# Altium project efx.PrjPCB
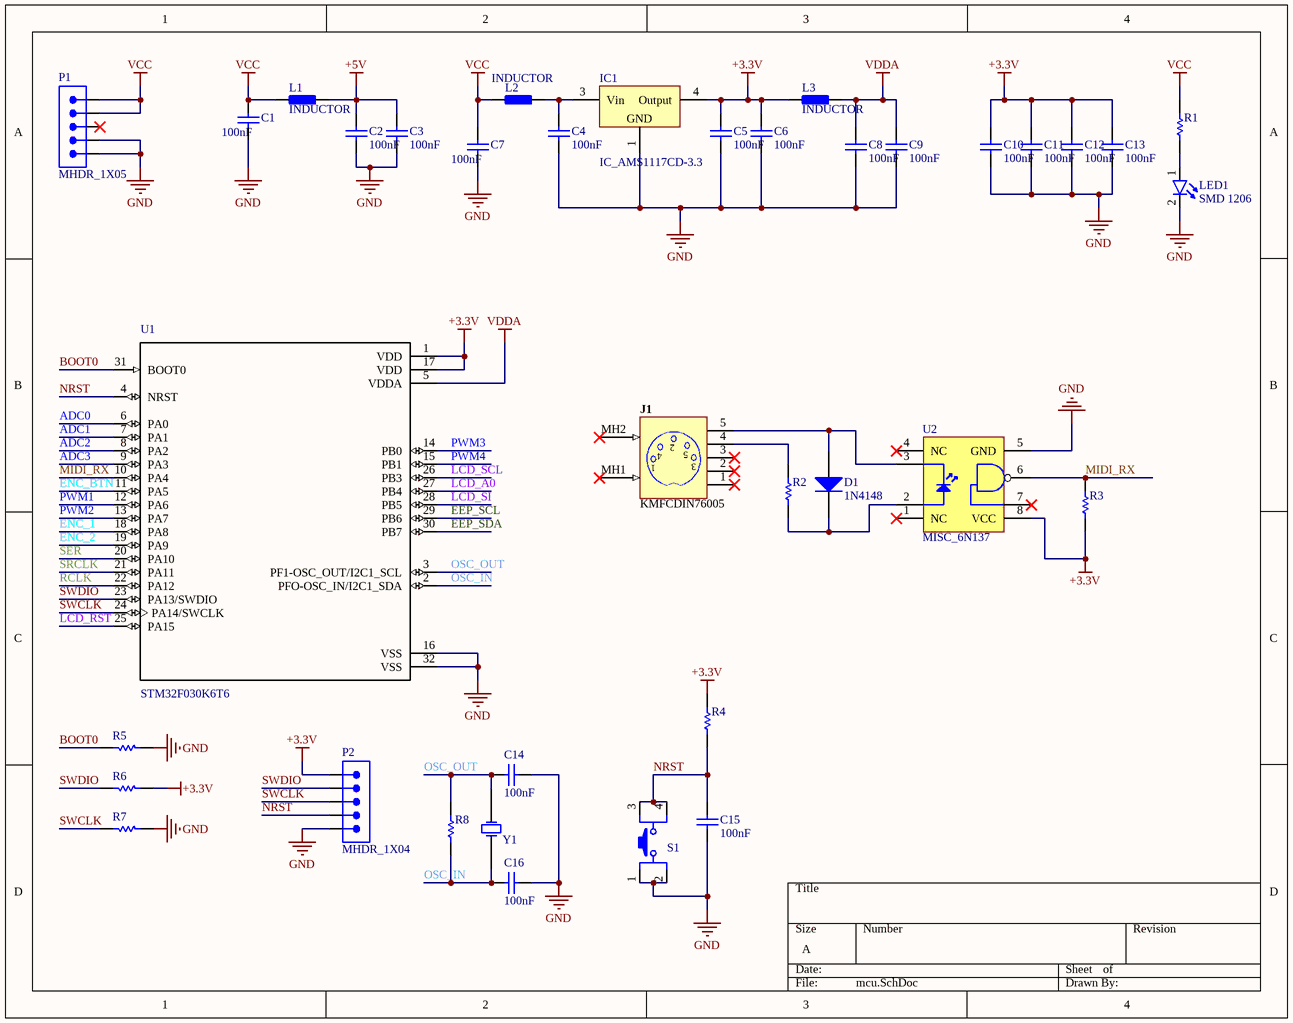
[diagram p0: mcu.SchDoc]
3 sheets, 120 parts. Net scope: global (net labels, ports and power ports of the same name join across sheets).
Board file: d_efx.PcbDoc
Sheets:
  mcu.SchDoc
  misc.SchDoc
  volumes.SchDoc

## Sheet mcu.SchDoc
size A

### Parts
C1  100nF  [CAPC3216M (1206)]
C2  100nF  [CAPC3216M (1206)]
C3  value 100nF  [CAPC3216M (1206)]  (hidden comment: 1uF)
C4  100nF  [CAPC3216M (1206)]
C5  100nF  [CAPC3216M (1206)]
C6  100nF  [CAPC3216M (1206)]
C7  100nF  [CAPC3216M (1206)]
C8  100nF  [CAPC3216M (1206)]
C9  value 100nF  [CAPC3216M (1206)]  (hidden comment: 1uF)
C10  100nF  [CAPC3216M (1206)]
C11  100nF  [CAPC3216M (1206)]
C12  100nF  [CAPC3216M (1206)]
C13  100nF  [CAPC3216M (1206)]
C14  100nF  [CAPC3216M (1206)]
C15  100nF  [CAPC3216M (1206)]
C16  100nF  [CAPC3216M (1206)]
D1  1N4148  [LL4148]
IC1  IC_AMS1117CD-3.3  [TO252-3M]
J1  KMFCDIN76005  [DIP_CON_DIN5]
L1  INDUCTOR  [INDC4532]
L2  INDUCTOR  [INDC4532]
L3  INDUCTOR  [INDC4532]
LED1  Size: SMD 1206  [LED SMD 1206]  (hidden comment: Red)
P1  MHDR_1X05  [MHDR1X05-254P]
P2  MHDR_1X04  [MHDR1X04-254P]
R1  1K  [RESC3216X60M (1206)]  (value not drawn)
R2  1K  [RESC3216X60M (1206)]  (value not drawn)
R3  1K  [RESC3216X60M (1206)]  (value not drawn)
R4  1K  [RESC3216X60M (1206)]  (value not drawn)
R5  1K  [RESC2012M (0805)]  (value not drawn)
R6  1K  [RESC3216X60M (1206)]  (value not drawn)
R7  1K  [RESC3216X60M (1206)]  (value not drawn)
R8  1K  [RESC3216X60M (1206)]  (value not drawn)
S1  SW_PB4A  [THT_ALPS_SKHHBVA010]  (value not drawn)
U1  STM32F030K6T6  [*QFP80P900X900X160-32N]
U2  MISC_6N137  [CDIP8]
Y1  11.0592 MHz  [XTAL]  (value not drawn)

### Nets
+3.3V: C5.1(+) C6.1(+) C10.1(+) C11.1(+) C12.1(+) C13.1(+) IC1.4(Output) L3.1 P2.1 R3.1 R4.2 R6.2 U1.1(VDD) U1.17(VDD) U2.8(VCC)
+5V: C2.1(+) C3.1(+) L1.2
GND: C1.2(-) C2.2(-) C3.2(-) C4.2(-) C5.2(-) C6.2(-) C7.2(-) C8.2(-) C9.2(-) C10.2(-) C11.2(-) C12.2(-) C13.2(-) C14.1(+) C15.2(-) C16.2(-) IC1.1(GND) LED1.2(K) P1.4 P1.5 P2.4 R5.2 R7.2 S1.1 S1.2 U1.16(VSS) U1.32(VSS) U2.5(GND)
VCC: C1.1(+) C7.1(+) L1.1 L2.1 P1.1 P1.2 R1.2
VDDA: C8.1(+) C9.1(+) L3.2 U1.5(VDDA)
ADC0: U1.6(PA0)
ADC1: U1.7(PA1)
ADC2: U1.8(PA2)
ADC3: U1.9(PA3)
BOOT0: R5.1 U1.31(BOOT0)
EEP_SCL: U1.29(PB6)
EEP_SDA: U1.30(PB7)
ENC_1: U1.18(PA8)
ENC_2: U1.19(PA9)
ENC_BTN: U1.11(PA5)
LCD_A0: U1.27(PB4)
LCD_RST: U1.25(PA15)
LCD_SCL: U1.26(PB3)
LCD_SI: U1.28(PB5)
MIDI_RX: R3.2 U1.10(PA4) U2.6(Vo)
NRST: C15.1(+) P2.4 R4.1 S1.3 S1.4 U1.4(NRST)
OSC_IN: C16.1(+) R8.1 U1.2(PFO-OSC_IN/I2C1_SDA) Y1.2(OSC2)
OSC_OUT: C14.2(-) R8.2 U1.3(PF1-OSC_OUT/I2C1_SCL) Y1.1(OSC1)
PWM1: U1.12(PA6)
PWM2: U1.13(PA7)
PWM3: U1.14(PB0)
PWM4: U1.15(PB1)
RCLK: U1.22(PA12)
SER: U1.20(PA10)
SRCLK: U1.21(PA11)
SWCLK: P2.3 R7.1 U1.24(PA14/SWCLK)
SWDIO: P2.2 R6.1 U1.23(PA13/SWDIO)
NetC4_1: C4.1(+) IC1.3(Vin) L2.2
NetD1_1: D1.1(A) J1.5 U2.3(K)
NetD1_2: D1.2(K) R2.2 U2.2(A)
NetJ1_4: J1.4 R2.1
NetLED1_1: LED1.1(A) R1.1

Not connected (* = marked no-connect by the designer): J1 1* 2* 3* MH1* MH2*; P1 3*; U2 1(NC)* 4(NC)* 7(Ve)*

### Library data of the parts
C1-C16 = CAP_Bipolar: Bipolar Capacitor; Voltage: 100V; Designer: Eng. Saeid Jorablo; Company: SJ Libraries; ComponentLink1Description: Datasheet; ComponentLink2Description: Reference; Publisher: SJ Unlimited; Mounting Technology: *; Mounting Technology: Surface Mount\Through-Hole; HelpURL: http://s3.picofile.com/file/7443264187/Coming_Soon_logo.gif; Status: Unreleased
  C1 C2 C4-C8 C10-C16: Value: 100nF
D1 = DIODE_1N4148: High Conductance Fast Diode; Designer: Eng. Saeid Jorablo; Company: SJ Libraries; Published: 8-Jun-2000; LatestRevisionDate: 17-Jul-2002; LatestRevisionNote: Re-released for DXP Platform.; PackageReference: DO-35; Publisher: SJ Unlimited; PackageDescription: Diode, Axial; Body 3.8 x 1.9 mm (LxDia. max), Lead Dia. 0.53 mm (max); Code_JEDEC: DO-204-AH; ComponentLink1Description: Datasheet; ComponentLink1URL: http://www.fairchildsemi.com/; ComponentLink2Description: Reference; ComponentLink2URL: http://www.fairchildsemi.com/ds/1N%2F1N4148.pdf; Mounting Technology: Surface Mount\Through-Hole; HelpURL: http://s3.picofile.com/file/7443264187/Coming_Soon_logo.gif; Status: Unreleased
IC1 = IC_AMS1117CD-3.3: 800mA LOW DROPOUT VOLTAGE REGULATOR; Manufacturer: Advanced Monolithic Systems, Inc.; Company: SJ Libraries; Designer: Eng. Saeid Jorablo; ESD Sensetive: True/False; Code_IPC: TO-252; ComponentLink1Description: Datasheet; ComponentLink1URL: http://www.advanced-monolithic.com/pdf/ds1117.pdf; ComponentLink2Description: Reference; ComponentLink2URL: http://www.advanced-monolithic.com/index.html; PackageDescription: D-PAK, 3-Pads, Body 6.2x6.7mm (max); PinCount: 3; Update: 6/5/2012; Category: Integrated Circuit; Status: Unrelease; HelpURL: http://s3.picofile.com/file/7443264187/Coming_Soon_logo.gif; Operating Temperature: -55 ~ +125 (C); Mounting Technology: Surface Mount; RoHS compliant: True/False
J1 = CON_DIN5: Socket, 5-way R/A DIN; Connector type: Right Angle; Max Current: mA; designer: Eng. Saeid Jorablo; Company: SJ Libraries; Mounting Technology: Through-Hole; Pin Count: 5; Status: Unreleased; Category: Connector; Publisher: SJ UnLimited; ComponentLink1Description: Datasheet; ComponentLink2Description: Reference; Update: 7/8/2012; HelpURL: http://s3.picofile.com/file/7443264187/Coming_Soon_logo.gif
L1-L3 = INDUCTOR: Code_IEC: 1005; Designer: Eng. Saeid Jorablo; Company: SJ Libraries; Value: 10mH; Published: 8-Jun-2000; LatestRevisionDate: 29-May-2009; LatestRevisionNote: IPC-7351 Footprint Added.; PackageReference: 0402-A; Publisher: SJ Unlimited; PackageDescription: Chip Inductor; Code_JEITA: 0402; ComponentLink1Description: Datasheet; ComponentLink2Description: Reference; Mounting Technology: Surface Mount\Through-Hole; HelpURL: http://s3.picofile.com/file/7443264187/Coming_Soon_logo.gif; Status: Unreleased
LED1 = LED: Designer: Eng. Saeid Jorablo; Company: SJ Libraries; ComponentLink1Description: Datasheet; ComponentLink2Description: Reference; Publisher: SJ Unlimited; Mounting Technology: Surface Mount\Through-Hole; Color: Red; HelpURL: http://s3.picofile.com/file/7443264187/Coming_Soon_logo.gif; Status: Unreleased
P1 P2 = MHDR_1X05: Male Header 1X05
R1-R8 = RES: Resistor; Designer: Eng. Saeid Jorablo; Company: SJ Libraries; Tolerance: 5%; Power: 1/8 W; Category: Resistors; ComponentLink1Description: Datasheet; ComponentLink2Description: Reference; PackageDescription: SMD & TH Resistors; Publisher: SJ Unlimited; Mounting Technology: Surface Mount\Through-Hole; HelpURL: http://s3.picofile.com/file/7443264187/Coming_Soon_logo.gif; Status: Unreleased; Value: 1K
S1 = SW_PB4A: 4 Pin Push Button Switch; Company: SJ Libraries; Designer: Eng. Saeid Jorablo; Mounting Technology: Surface Mount\Through-Hole; ComponentLink1Description: Datasheet; Pin Count: 0; Update Date: 6/3/2012; Category: MISC; HelpURL: http://s3.picofile.com/file/7443264187/Coming_Soon_logo.gif
U1 = STM32F030K6T6: MCU 32-Bit STM32F ARM Cortex M0 RISC 32KB Flash 2.5V/3.3V 32-Pin LQFP Tray; MF: STMicroelectronics; MP: STM32F030K6T6; Price: None; SnapEDA_Link: https://www.snapeda.com/parts/STM32F030K6T6/STMicroelectronics/view-part/?ref=snap; Availability: Unavailable; Package: LQFP-32 STMicroelectronics; Value: *
U2 = MISC_6N137: HIGH SPEED-10 MBit/s  LOGIC GATE OPTOCOUPLERS; Designer: Eng. Saeid Jorablo; Company: SJ Libraries; Mounting Technology: Surface Mount\Through-Hole; ComponentLink1Description: Datasheet; Pin Count: 0; Update Date: 6/3/2012; Category: MISC; HelpURL: http://s3.picofile.com/file/7443264187/Coming_Soon_logo.gif
Y1 = XTAL_Crystal: XTAL Crystal; Company: SJ Libraries; Designer: Eng. Saeid Jorablo; Design Date: 11/04/2011; ComponentLink1Description: Datasheet; ComponentLink2Description: Reference; Publisher: SJ Unlimited; Mounting Technology: Surface Mount\Through-Hole; Value: 11.0592 MHz; HelpURL: http://s3.picofile.com/file/7443264187/Coming_Soon_logo.gif; Status: Unreleased

## Sheet misc.SchDoc
size A
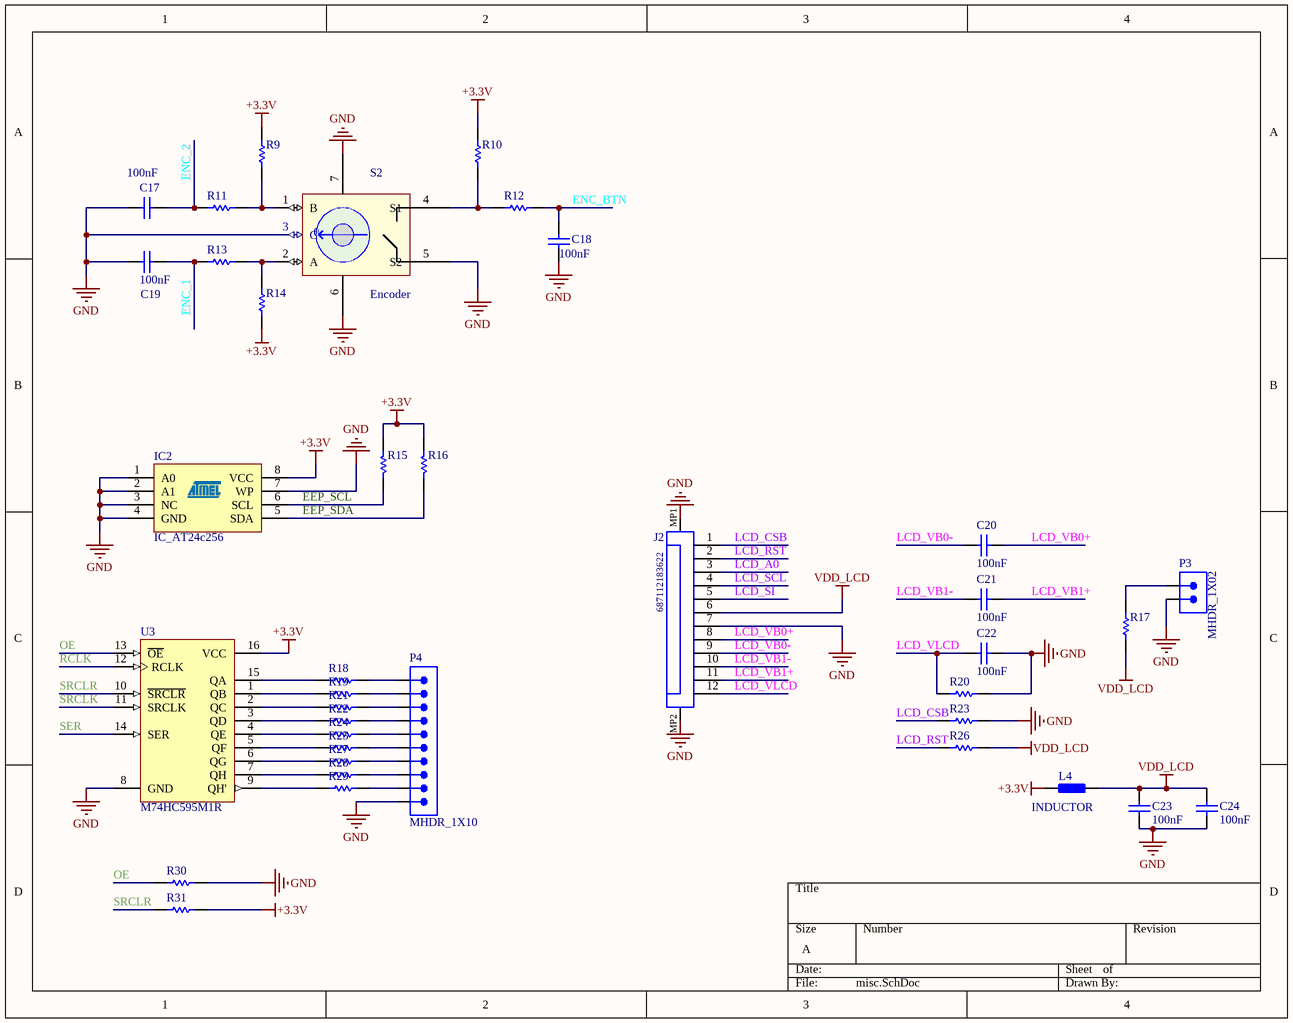
[diagram p1: misc.SchDoc]

### Parts
C17  100nF  [CAPC3216M (1206)]
C18  100nF  [CAPC3216M (1206)]
C19  100nF  [CAPC3216M (1206)]
C20  100nF  [CAPC3216M (1206)]
C21  100nF  [CAPC3216M (1206)]
C22  100nF  [CAPC3216M (1206)]
C23  100nF  [CAPC3216M (1206)]
C24  100nF  [CAPC3216M (1206)]
IC2  IC_AT24c256  [CDIP8]
J2  687112183622  [PCBComponent_1]
L4  INDUCTOR  [INDC4532]
P3  MHDR_1X02  [MHDR1X02-254P]
P4  MHDR_1X10  [MHDR1X10-254P - E]
R9  1K  [RESC3216X60M (1206)]  (value not drawn)
R10  1K  [RESC3216X60M (1206)]  (value not drawn)
R11  1K  [RESC3216X60M (1206)]  (value not drawn)
R12  1K  [RESC3216X60M (1206)]  (value not drawn)
R13  1K  [RESC3216X60M (1206)]  (value not drawn)
R14  1K  [RESC3216X60M (1206)]  (value not drawn)
R15  1K  [RESC3216X60M (1206)]  (value not drawn)
R16  1K  [RESC3216X60M (1206)]  (value not drawn)
R17  1K  [RESC3216X60M (1206)]  (value not drawn)
R18  1K  [RESC3216X60M (1206)]  (value not drawn)
R19  1K  [RESC3216X60M (1206)]  (value not drawn)
R20  1K  [RESC3216X60M (1206)]  (value not drawn)
R21  1K  [RESC3216X60M (1206)]  (value not drawn)
R22  1K  [RESC3216X60M (1206)]  (value not drawn)
R23  1K  [RESC3216X60M (1206)]  (value not drawn)
R24  1K  [RESC3216X60M (1206)]  (value not drawn)
R25  1K  [RESC3216X60M (1206)]  (value not drawn)
R26  1K  [RESC3216X60M (1206)]  (value not drawn)
R27  1K  [RESC3216X60M (1206)]  (value not drawn)
R28  1K  [RESC3216X60M (1206)]  (value not drawn)
R29  1K  [RESC3216X60M (1206)]  (value not drawn)
R30  1K  [RESC3216X60M (1206)]  (value not drawn)
R31  1K  [RESC3216X60M (1206)]  (value not drawn)
S2  Encoder  [Encoder]
U3  M74HC595M1R  [SO16_L]

### Nets
+3.3V: IC2.8(VCC) L4.1 R9.2 R10.2 R14.1 R15.1 R16.1 R31.1 U3.16(VCC)
GND: C17.1(+) C18.2(-) C19.1(+) C22.2(-) C23.2(-) C24.2(-) IC2.1(A0) IC2.2(A1) IC2.3(NC) IC2.4(GND) IC2.7(WP) J2.7 J2.MP1 J2.MP2 P3.2 P4.10 R20.1 R23.1 R30.1 S2.3(C) S2.5(S2) S2.6(CHASIS) S2.7(CHASIS) U3.8(GND)
VDD_LCD: C23.1(+) C24.1(+) J2.6 L4.2 R17.2 R26.1
EEP_SCL: IC2.6(SCL) R15.2
EEP_SDA: IC2.5(SDA) R16.2
ENC_1: C19.2(-) R13.2
ENC_2: C17.2(-) R11.2
ENC_BTN: C18.1(+) R12.1
LCD_A0: J2.3
LCD_CSB: J2.1 R23.2
LCD_RST: J2.2 R26.2
LCD_SCL: J2.4
LCD_SI: J2.5
LCD_VB0+: C20.1(+) J2.8
LCD_VB0-: C20.2(-) J2.9
LCD_VB1+: C21.1(+) J2.11
LCD_VB1-: C21.2(-) J2.10
LCD_VLCD: C22.1(+) J2.12 R20.2
OE: R30.2 U3.13(~{OE})
RCLK: U3.12(RCLK)
SER: U3.14(SER)
SRCLK: U3.11(SRCLK)
SRCLR: R31.2 U3.10(~{SRCLR})
NetP3_1: P3.1 R17.1
NetP4_1: P4.1 R18.1
NetP4_2: P4.2 R19.1
NetP4_3: P4.3 R21.1
NetP4_4: P4.4 R22.1
NetP4_5: P4.5 R24.1
NetP4_6: P4.6 R25.1
NetP4_7: P4.7 R27.1
NetP4_8: P4.8 R28.1
NetP4_9: P4.9 R29.1
NetR9_1: R9.1 R11.1 S2.1(B)
NetR10_1: R10.1 R12.2 S2.4(S1)
NetR13_1: R13.1 R14.2 S2.2(A)
NetR18_2: R18.2 U3.15(QA)
NetR19_2: R19.2 U3.1(QB)
NetR21_2: R21.2 U3.2(QC)
NetR22_2: R22.2 U3.3(QD)
NetR24_2: R24.2 U3.4(QE)
NetR25_2: R25.2 U3.5(QF)
NetR27_2: R27.2 U3.6(QG)
NetR28_2: R28.2 U3.7(QH)
NetR29_2: R29.2 U3.9(QH')

### Notes on the sheet
- (in symbol Encoder) 0

### Library data of the parts
C17-C24 = CAP_Bipolar: as C1 on sheet mcu; ComponentLink1Description: Datasheet; ComponentLink2Description: Reference; Publisher: SJ Unlimited; Mounting Technology: *; Mounting Technology: Surface Mount\Through-Hole; HelpURL: http://s3.picofile.com/file/7443264187/Coming_Soon_logo.gif; Status: Unreleased; Value: 100nF
IC2 = IC_AT24c256: EEPROM Memory; Designer: Eng. Saeid Jorablo; Company: SJ Libraries; Revision 2: 7/1/2012: Add Suppliers; ESD Sensetive: True/False; ComponentLink1Description: Datasheet; ComponentLink1URL: www.datasheet4u.com; ComponentLink2Description: Reference; PinCount: 8; Update: 6/5/2012; Supplier 1: Digi-Key; Supplier 2: Digi-Key; Supplier 3: Digi-Key; Supplier Part Number 1: AT24C256-10TI-2.7-ND; Supplier Part Number 2: AT24C256N-10SC-ND; Supplier Part Number 3: AT24C256-10PI-2.7-ND; Category: Integrated Circuit; Status: Unrelease; HelpURL: http://s3.picofile.com/file/7443264187/Coming_Soon_logo.gif; Operating Temperature: -55 ~ +125 (C); Mounting Technology: Surface Mount; RoHS compliant: True/False
J2 = 687112183622: SMT ZIF Connectors Low Profile WR-FPC, Horizontal, Top Contact, pitch 0.6 mm, 12 pins; Rated Current: 0.4 A; Contact Resistance: 30 mOhm; Withstanding Voltage: 250 VAC; Working Voltage: 50 VAC; Pin Number: 12; Pitch: 0.6 mm; ComponentLink1Description: Manufacturer; ComponentLink1URL: http://www.we-online.de; ComponentLink2Description: Datasheet; ComponentLink2URL: https://katalog.we-online.de/em/datasheet/687112183622.pdf; Part Number: 687112183622; Published Date: August 2018; Publisher: Wurth Elektronik; Operating Temperature: -25 to 85 degC; Packaging: Tape and Reel; Mounting Technology: SMT; Orientation: Horizontal; Contact Design: Top Contact
L4 = INDUCTOR: as L1 on sheet mcu; Published: 8-Jun-2000; LatestRevisionDate: 29-May-2009; LatestRevisionNote: IPC-7351 Footprint Added.; PackageReference: 0402-A; Publisher: SJ Unlimited; PackageDescription: Chip Inductor; Code_JEITA: 0402; ComponentLink1Description: Datasheet; ComponentLink2Description: Reference; Mounting Technology: Surface Mount\Through-Hole; HelpURL: http://s3.picofile.com/file/7443264187/Coming_Soon_logo.gif; Status: Unreleased
P3 = MHDR_1X02: Male Header 1X02
P4 = MHDR_1X10: Male Header 1X10
R9-R31 = RES: as R1 on sheet mcu; Category: Resistors; ComponentLink1Description: Datasheet; ComponentLink2Description: Reference; PackageDescription: SMD & TH Resistors; Publisher: SJ Unlimited; Mounting Technology: Surface Mount\Through-Hole; HelpURL: http://s3.picofile.com/file/7443264187/Coming_Soon_logo.gif; Status: Unreleased; Value: 1K
U3 = M74HC595M1R: 8 Bit Shift Register with Output Latches (3 STATE); Published: 8-Jun-2000; LatestRevisionDate: 13-Apr-2006; LatestRevisionNote: IPC-7351 Footprint Added.; DatasheetVersion: Apr-1993; PackageVersion: May-1998; PackageReference: SO16; Publisher: Altium Limited; PackageDescription: 16-Pin Small Outline Integrated Circuit 1.27 mm Pitch; Code_IPC: SOIC127P600-16; ComponentLink1Description: Manufacturer Link; ComponentLink1URL: http://www.st.com/; ComponentLink2Description: Datasheet; ComponentLink2URL: http://www.st.com/stonline/products/literature/ds/1989/m74hc595.pdf

## Sheet volumes.SchDoc
size A
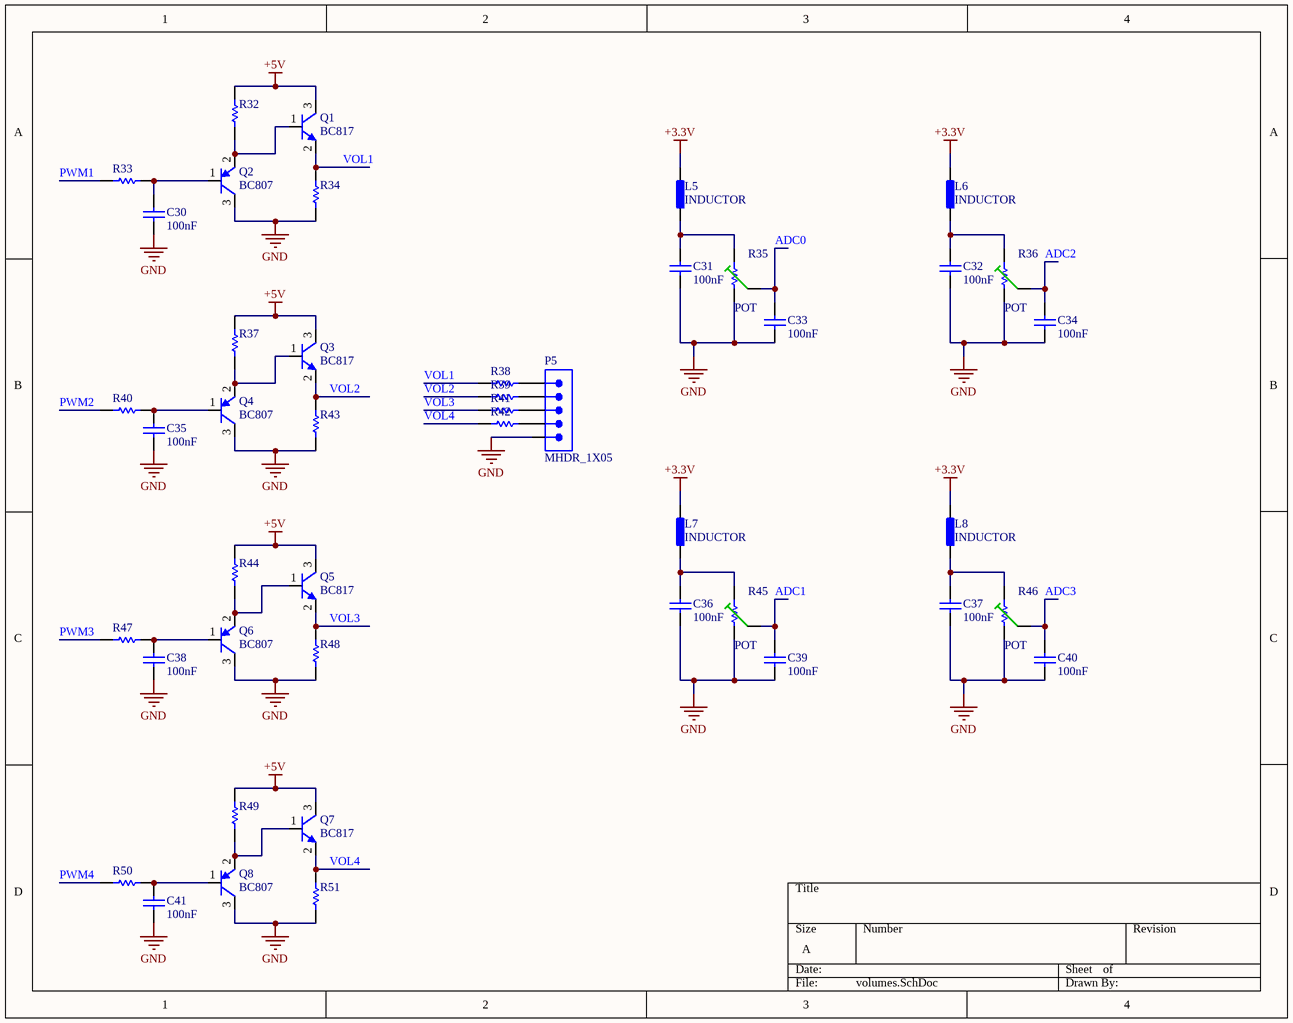
[diagram p2: volumes.SchDoc]

### Parts
C30  100nF  [CAPC3216M (1206)]
C31  100nF  [CAPC3216M (1206)]
C32  100nF  [CAPC3216M (1206)]
C33  100nF  [CAPC3216M (1206)]
C34  100nF  [CAPC3216M (1206)]
C35  100nF  [CAPC3216M (1206)]
C36  100nF  [CAPC3216M (1206)]
C37  100nF  [CAPC3216M (1206)]
C38  100nF  [CAPC3216M (1206)]
C39  100nF  [CAPC3216M (1206)]
C40  100nF  [CAPC3216M (1206)]
C41  100nF  [CAPC3216M (1206)]
L5  INDUCTOR  [INDC3216]
L6  INDUCTOR  [INDC3216]
L7  INDUCTOR  [INDC3216]
L8  INDUCTOR  [INDC3216]
P5  MHDR_1X05  [MHDR1X05-254P]
Q1  BC817  [SOT23_BEC_M]
Q2  BC807  [SOT23_BEC_M]
Q3  BC817  [SOT23_BEC_M]
Q4  BC807  [SOT23_BEC_M]
Q5  BC817  [SOT23_BEC_M]
Q6  BC807  [SOT23_BEC_M]
Q7  BC817  [SOT23_BEC_M]
Q8  BC807  [SOT23_BEC_M]
R32  1K  [RESC3216X60M (1206)]  (value not drawn)
R33  1K  [RESC3216X60M (1206)]  (value not drawn)
R34  1K  [RESC3216X60M (1206)]  (value not drawn)
R35  POT  [EVUF]
R36  POT  [EVUF]
R37  1K  [RESC3216X60M (1206)]  (value not drawn)
R38  1K  [RESC3216X60M (1206)]  (value not drawn)
R39  1K  [RESC3216X60M (1206)]  (value not drawn)
R40  1K  [RESC3216X60M (1206)]  (value not drawn)
R41  1K  [RESC3216X60M (1206)]  (value not drawn)
R42  1K  [RESC3216X60M (1206)]  (value not drawn)
R43  1K  [RESC3216X60M (1206)]  (value not drawn)
R44  1K  [RESC3216X60M (1206)]  (value not drawn)
R45  POT  [EVUF]
R46  POT  [EVUF]
R47  1K  [RESC3216X60M (1206)]  (value not drawn)
R48  1K  [RESC3216X60M (1206)]  (value not drawn)
R49  1K  [RESC3216X60M (1206)]  (value not drawn)
R50  1K  [RESC3216X60M (1206)]  (value not drawn)
R51  1K  [RESC3216X60M (1206)]  (value not drawn)

### Nets
+3.3V: L5.2 L6.2 L7.2 L8.2
+5V: Q1.3(C) Q3.3(C) Q5.3(C) Q7.3(C) R32.1 R37.1 R44.1 R49.1
GND: C30.2(-) C31.2(-) C32.2(-) C33.2(-) C34.2(-) C35.2(-) C36.2(-) C37.2(-) C38.2(-) C39.2(-) C40.2(-) C41.2(-) P5.5 Q2.3(C) Q4.3(C) Q6.3(C) Q8.3(C) R34.2 R35.3(CW) R36.3(CW) R43.2 R45.3(CW) R46.3(CW) R48.2 R51.2
ADC0: C33.1(+) R35.2(WIPER)
ADC1: C39.1(+) R45.2(WIPER)
ADC2: C34.1(+) R36.2(WIPER)
ADC3: C40.1(+) R46.2(WIPER)
PWM1: R33.2
PWM2: R40.2
PWM3: R47.2
PWM4: R50.2
VOL1: Q1.2(E) R34.1 R38.2
VOL2: Q3.2(E) R39.2 R43.1
VOL3: Q5.2(E) R41.2 R48.1
VOL4: Q7.2(E) R42.2 R51.1
NetC30_1: C30.1(+) Q2.1(B) R33.1
NetC31_1: C31.1(+) L5.1 R35.1(CCW)
NetC32_1: C32.1(+) L6.1 R36.1(CCW)
NetC35_1: C35.1(+) Q4.1(B) R40.1
NetC36_1: C36.1(+) L7.1 R45.1(CCW)
NetC37_1: C37.1(+) L8.1 R46.1(CCW)
NetC38_1: C38.1(+) Q6.1(B) R47.1
NetC41_1: C41.1(+) Q8.1(B) R50.1
NetP5_1: P5.1 R38.1
NetP5_2: P5.2 R39.1
NetP5_3: P5.3 R41.1
NetP5_4: P5.4 R42.1
NetQ1_1: Q1.1(B) Q2.2(E) R32.2
NetQ3_1: Q3.1(B) Q4.2(E) R37.2
NetQ5_1: Q5.1(B) Q6.2(E) R44.2
NetQ7_1: Q7.1(B) Q8.2(E) R49.2

### Library data of the parts
C30-C41 = CAP_Bipolar: as C1 on sheet mcu; ComponentLink1Description: Datasheet; ComponentLink2Description: Reference; Publisher: SJ Unlimited; Mounting Technology: *; Mounting Technology: Surface Mount\Through-Hole; HelpURL: http://s3.picofile.com/file/7443264187/Coming_Soon_logo.gif; Status: Unreleased; Value: 100nF
L5-L8 = INDUCTOR: as L1 on sheet mcu; Published: 8-Jun-2000; LatestRevisionDate: 29-May-2009; LatestRevisionNote: IPC-7351 Footprint Added.; PackageReference: 0402-A; Publisher: SJ Unlimited; PackageDescription: Chip Inductor; Code_JEITA: 0402; ComponentLink1Description: Datasheet; ComponentLink2Description: Reference; Mounting Technology: Surface Mount\Through-Hole; HelpURL: http://s3.picofile.com/file/7443264187/Coming_Soon_logo.gif; Status: Unreleased
P5 = MHDR_1X05: Male Header 1X05
Q1 Q3 Q5 Q7 = NPN_BEC: NPN Bipolar Transistor; Designer: Eng. Saeid Jorablo; Company: SJ Libraries; Published: 8-Jun-2000; LatestRevisionDate: 29-May-2009; LatestRevisionNote: IPC-7351 Footprint Added.; PackageVersion: Aug-1999; PackageReference: SOT-23B; Publisher: SJ Unlimited; PackageDescription: 3-Pin SOT-23 Package 0.95 mm Pitch, 2.4 mm Lead Span; ComponentLink1Description: Datasheet; ComponentLink2Description: Reference; Mounting Technology: Surface Mount\Through-Hole; HelpURL: http://s3.picofile.com/file/7443264187/Coming_Soon_logo.gif; Status: Unreleased
Q2 Q4 Q6 Q8 = PNP_BEC: PNP Bipolar Transistor; Designer: Eng. Saeid Jorablo; Company: SJ Libraries; Published: 8-Jun-2000; LatestRevisionDate: 29-May-2009; LatestRevisionNote: IPC-7351 Footprint Added.; PackageVersion: Aug-1999; PackageReference: SOT-23B; Publisher: SJ Unlimited; PackageDescription: 3-Pin SOT-23 Package 0.95 mm Pitch, 2.4 mm Lead Span; ComponentLink1Description: Datasheet; ComponentLink2Description: Reference; Mounting Technology: Surface Mount\Through-Hole; HelpURL: http://s3.picofile.com/file/7443264187/Coming_Soon_logo.gif; Status: Unreleased
R32-R34 R37-R44 R47-R51 = RES: as R1 on sheet mcu; Category: Resistors; ComponentLink1Description: Datasheet; ComponentLink2Description: Reference; PackageDescription: SMD & TH Resistors; Publisher: SJ Unlimited; Mounting Technology: Surface Mount\Through-Hole; HelpURL: http://s3.picofile.com/file/7443264187/Coming_Soon_logo.gif; Status: Unreleased; Value: 1K
R35 R36 R45 R46 = RES_POT_LIN

## Nets that join several sheets
+3.3V: mcu (15 pins), misc (9 pins), volumes (L5.2 L6.2 L7.2 L8.2)
+5V: mcu (C2.1 C3.1 L1.2), volumes (8 pins)
GND: mcu (28 pins), misc (24 pins), volumes (25 pins)
ADC0: mcu (U1.6), volumes (C33.1 R35.2)
ADC1: mcu (U1.7), volumes (C39.1 R45.2)
ADC2: mcu (U1.8), volumes (C34.1 R36.2)
ADC3: mcu (U1.9), volumes (C40.1 R46.2)
EEP_SCL: mcu (U1.29), misc (IC2.6 R15.2)
EEP_SDA: mcu (U1.30), misc (IC2.5 R16.2)
ENC_1: mcu (U1.18), misc (C19.2 R13.2)
ENC_2: mcu (U1.19), misc (C17.2 R11.2)
ENC_BTN: mcu (U1.11), misc (C18.1 R12.1)
LCD_A0: mcu (U1.27), misc (J2.3)
LCD_RST: mcu (U1.25), misc (J2.2 R26.2)
LCD_SCL: mcu (U1.26), misc (J2.4)
LCD_SI: mcu (U1.28), misc (J2.5)
PWM1: mcu (U1.12), volumes (R33.2)
PWM2: mcu (U1.13), volumes (R40.2)
PWM3: mcu (U1.14), volumes (R47.2)
PWM4: mcu (U1.15), volumes (R50.2)
RCLK: mcu (U1.22), misc (U3.12)
SER: mcu (U1.20), misc (U3.14)
SRCLK: mcu (U1.21), misc (U3.11)